# Altium schematic sheet FC_Sheet1.SchDoc
size 431 x 279 mm; SheetNumber: 1; SheetTotal: 1
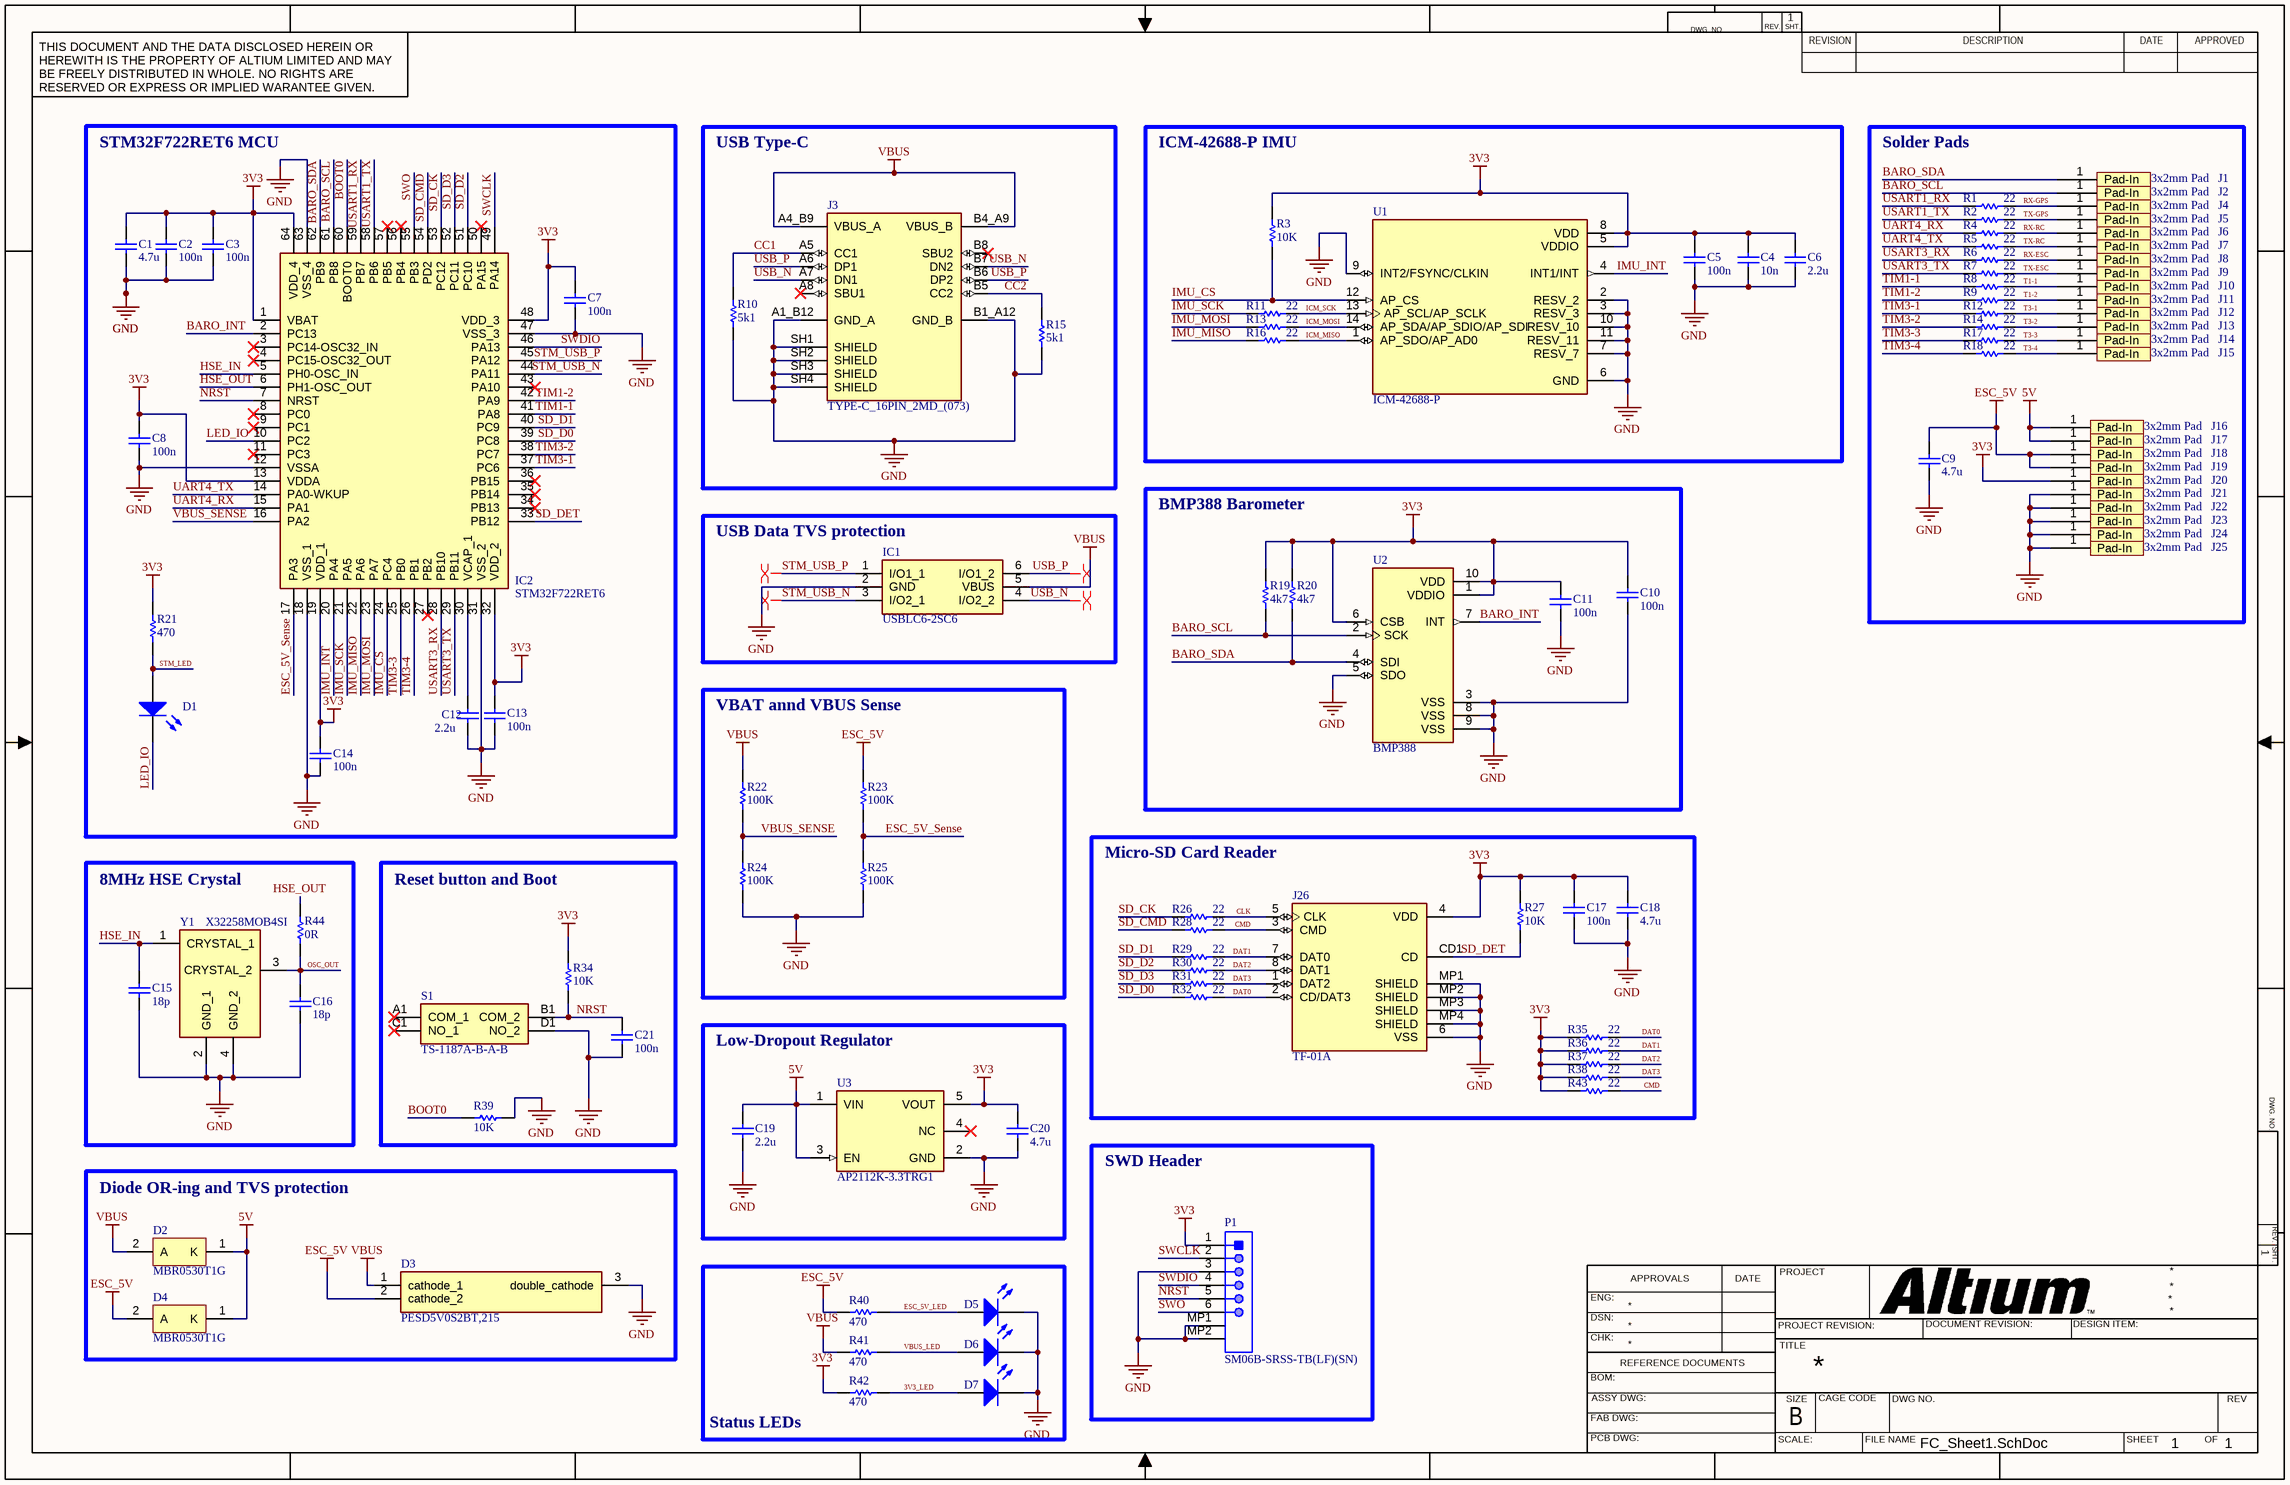
[diagram p0: FC_Sheet1.SchDoc]

## Parts
C1  value 4.7u  [CAPC1608X90X40NL10T20]  (hidden comment: 4.7uF 0603 Capacitor)
C2  value 100n  [CAPC0402(1005)60_L]  (hidden comment: 100nF 0402 Capacitor)
C3  value 100n  [CAPC0402(1005)60_L]  (hidden comment: 100nF 0402 Capacitor)
C4  value 10n  [CAPC0402(1005)60_L]  (hidden comment: 10nF 0402 Capacitor)
C5  value 100n  [CAPC0402(1005)60_L]  (hidden comment: 100nF 0402 Capacitor)
C6  value 2.2u  [CAPC1608X90X40NL10T20]  (hidden comment: 2.2uF 0603 Capacitor)
C7  value 100n  [CAPC0402(1005)60_L]  (hidden comment: 100nF 0402 Capacitor)
C8  value 100n  [CAPC0402(1005)60_L]  (hidden comment: 100nF 0402 Capacitor)
C9  value 4.7u  [CAPC1608X90X40NL10T20]  (hidden comment: 4.7uF 0603 Capacitor)
C10  value 100n  [CAPC0402(1005)60_L]  (hidden comment: 100nF 0402 Capacitor)
C11  value 100n  [CAPC0402(1005)60_L]  (hidden comment: 100nF 0402 Capacitor)
C12  value 2.2u  [CAPC1608X90X40NL10T20]  (hidden comment: 2.2uF 0603 Capacitor)
C13  value 100n  [CAPC0402(1005)60_L]  (hidden comment: 100nF 0402 Capacitor)
C14  value 100n  [CAPC0402(1005)60_L]  (hidden comment: 100nF 0402 Capacitor)
C15  value 18p  [CAPC0402(1005)60_L]  (hidden comment: 18pF 0402 Capacitor)
C16  value 18p  [CAPC0402(1005)60_L]  (hidden comment: 18pF 0402 Capacitor)
C17  value 100n  [CAPC0402(1005)60_L]  (hidden comment: 100nF 0402 Capacitor)
C18  value 4.7u  [CAPC1608X90X40NL10T20]  (hidden comment: 4.7uF 0603 Capacitor)
C19  value 2.2u  [CAPC1608X90X40NL10T20]  (hidden comment: 2.2uF 0603 Capacitor)
C20  value 4.7u  [CAPC1608X90X40NL10T20]  (hidden comment: 4.7uF 0603 Capacitor)
C21  value 100n  [CAPC0402(1005)60_L]  (hidden comment: 100nF 0402 Capacitor)
D1  Red 0603 Light-Emitting Diode  [LTST-C191KRKT_V]  (value not drawn)
D2  MBR0530T1G  [ONSC-SOD-123-2-425-04_V]
D3  PESD5V0S2BT,215  [SOT95P230X110-3N]
D4  MBR0530T1G  [ONSC-SOD-123-2-425-04_V]
D5  Red 0603 Light-Emitting Diode  [LTST-C191KRKT_V]  (value not drawn)
D6  Red 0603 Light-Emitting Diode  [LTST-C191KRKT_V]  (value not drawn)
D7  Red 0603 Light-Emitting Diode  [LTST-C191KRKT_V]  (value not drawn)
IC1  USBLC6-2SC6  [SOT95P280X145-6N]
IC2  STM32F722RET6  [QFP50P1200X1200X160-64N]
J1  3x2mm Pad  [3x2mm Pad-Footprint-1]  (no BOM)
J2  3x2mm Pad  [3x2mm Pad-Footprint-1]  (no BOM)
J3  TYPE-C_16PIN_2MD_(073)  [SHOUHAN_TYPE-C_16PIN_2MD_(073)]
J4  3x2mm Pad  [3x2mm Pad-Footprint-1]  (no BOM)
J5  3x2mm Pad  [3x2mm Pad-Footprint-1]  (no BOM)
J6  3x2mm Pad  [3x2mm Pad-Footprint-1]  (no BOM)
J7  3x2mm Pad  [3x2mm Pad-Footprint-1]  (no BOM)
J8  3x2mm Pad  [3x2mm Pad-Footprint-1]  (no BOM)
J9  3x2mm Pad  [3x2mm Pad-Footprint-1]  (no BOM)
J10  3x2mm Pad  [3x2mm Pad-Footprint-1]  (no BOM)
J11  3x2mm Pad  [3x2mm Pad-Footprint-1]  (no BOM)
J12  3x2mm Pad  [3x2mm Pad-Footprint-1]  (no BOM)
J13  3x2mm Pad  [3x2mm Pad-Footprint-1]  (no BOM)
J14  3x2mm Pad  [3x2mm Pad-Footprint-1]  (no BOM)
J15  3x2mm Pad  [3x2mm Pad-Footprint-1]  (no BOM)
J16  3x2mm Pad  [3x2mm Pad-Footprint-1]  (no BOM)
J17  3x2mm Pad  [3x2mm Pad-Footprint-1]  (no BOM)
J18  3x2mm Pad  [3x2mm Pad-Footprint-1]  (no BOM)
J19  3x2mm Pad  [3x2mm Pad-Footprint-1]  (no BOM)
J20  3x2mm Pad  [3x2mm Pad-Footprint-1]  (no BOM)
J21  3x2mm Pad  [3x2mm Pad-Footprint-1]  (no BOM)
J22  3x2mm Pad  [3x2mm Pad-Footprint-1]  (no BOM)
J23  3x2mm Pad  [3x2mm Pad-Footprint-1]  (no BOM)
J24  3x2mm Pad  [3x2mm Pad-Footprint-1]  (no BOM)
J25  3x2mm Pad  [3x2mm Pad-Footprint-1]  (no BOM)
J26  TF-01A  [TF-01A]
P1  SM06B-SRSS-TB(LF)(SN)  [JST-SM06B-SRSS-TB_V]
R1  value 22  [RESC0402(1005)_L]  (hidden comment: 22R 0402 Resistor)
R2  value 22  [RESC0402(1005)_L]  (hidden comment: 22R 0402 Resistor)
R3  value 10K  [RESC0402(1005)_L]  (hidden comment: 10k 0402 Resistor)
R4  value 22  [RESC0402(1005)_L]  (hidden comment: 22R 0402 Resistor)
R5  value 22  [RESC0402(1005)_L]  (hidden comment: 22R 0402 Resistor)
R6  value 22  [RESC0402(1005)_L]  (hidden comment: 22R 0402 Resistor)
R7  value 22  [RESC0402(1005)_L]  (hidden comment: 22R 0402 Resistor)
R8  value 22  [RESC0402(1005)_L]  (hidden comment: 22R 0402 Resistor)
R9  value 22  [RESC0402(1005)_L]  (hidden comment: 22R 0402 Resistor)
R10  value 5k1  [RESC0402(1005)_L]  (hidden comment: 5k1 0402 Resistor)
R11  value 22  [RESC0402(1005)_L]  (hidden comment: 22R 0402 Resistor)
R12  value 22  [RESC0402(1005)_L]  (hidden comment: 22R 0402 Resistor)
R13  value 22  [RESC0402(1005)_L]  (hidden comment: 22R 0402 Resistor)
R14  value 22  [RESC0402(1005)_L]  (hidden comment: 22R 0402 Resistor)
R15  value 5k1  [RESC0402(1005)_L]  (hidden comment: 5k1 0402 Resistor)
R16  value 22  [RESC0402(1005)_L]  (hidden comment: 22R 0402 Resistor)
R17  value 22  [RESC0402(1005)_L]  (hidden comment: 22R 0402 Resistor)
R18  value 22  [RESC0402(1005)_L]  (hidden comment: 22R 0402 Resistor)
R19  value 4k7  [RESC0402(1005)_L]  (hidden comment: 4k7 0402 Resistor)
R20  value 4k7  [RESC0402(1005)_L]  (hidden comment: 4k7 0402 Resistor)
R21  value 470  [RESC1608X55X25NL10T15]  (hidden comment: 470R 0603 Resistor)
R22  value 100K  [RESC0402(1005)_L]  (hidden comment: 100k 0402 Resistor)
R23  value 100K  [RESC0402(1005)_L]  (hidden comment: 100k 0402 Resistor)
R24  value 100K  [RESC0402(1005)_L]  (hidden comment: 100k 0402 Resistor)
R25  value 100K  [RESC0402(1005)_L]  (hidden comment: 100k 0402 Resistor)
R26  value 22  [RESC0402(1005)_L]  (hidden comment: 22R 0402 Resistor)
R27  value 10K  [RESC0402(1005)_L]  (hidden comment: 10k 0402 Resistor)
R28  value 22  [RESC0402(1005)_L]  (hidden comment: 22R 0402 Resistor)
R29  value 22  [RESC0402(1005)_L]  (hidden comment: 22R 0402 Resistor)
R30  value 22  [RESC0402(1005)_L]  (hidden comment: 22R 0402 Resistor)
R31  value 22  [RESC0402(1005)_L]  (hidden comment: 22R 0402 Resistor)
R32  value 22  [RESC0402(1005)_L]  (hidden comment: 22R 0402 Resistor)
R34  value 10K  [RESC0402(1005)_L]  (hidden comment: 10k 0402 Resistor)
R35  value 22  [RESC0402(1005)_L]  (hidden comment: 22R 0402 Resistor)
R36  value 22  [RESC0402(1005)_L]  (hidden comment: 22R 0402 Resistor)
R37  value 22  [RESC0402(1005)_L]  (hidden comment: 22R 0402 Resistor)
R38  value 22  [RESC0402(1005)_L]  (hidden comment: 22R 0402 Resistor)
R39  value 10K  [RESC0402(1005)_L]  (hidden comment: 10k 0402 Resistor)
R40  value 470  [RESC1608X55X25NL10T15]  (hidden comment: 470R 0603 Resistor)
R41  value 470  [RESC1608X55X25NL10T15]  (hidden comment: 470R 0603 Resistor)
R42  value 470  [RESC1608X55X25NL10T15]  (hidden comment: 470R 0603 Resistor)
R43  value 22  [RESC0402(1005)_L]  (hidden comment: 22R 0402 Resistor)
R44  value 0R  [RESC0402(1005)_L]  (hidden comment: 0R 0402 Resistor)
S1  TS-1187A-B-A-B  [TS1187ABAB]
U1  ICM-42688-P  [PQFN50P300X250X97-14N]
U2  BMP388  [PQFN50P200X200X80-10N]
U3  AP2112K-3.3TRG1  [FP-SOT25-IPC_A]
Y1  X32258MOB4SI  [X32258MOB4SI]

## Blocks framed on the sheet
STM32F722RET6 MCU: C1-C3 C7 C8 C12-C14 D1 IC2 R21
USB Type-C: J3 R10 R15
ICM-42688-P IMU: C4-C6 R3 R11 R13 R16 U1
Solder Pads: C9 J1 J2 J4-J25 R1 R2 R4-R9 R12 R14 R17 R18
USB Data TVS protection: IC1
BMP388 Barometer: C10 C11 R19 R20 U2
VBAT annd VBUS Sense: R22-R25
8MHz HSE Crystal: C15 C16 R44 Y1
Reset button and Boot: C21 R34 R39 S1
Micro-SD Card Reader: C17 C18 J26 R26-R32 R35-R38 R43
Low-Dropout Regulator: C19 C20 U3
Diode OR-ing and TVS protection: D2-D4
SWD Header: P1
Status LEDs: D5-D7 R40-R42

## Nets
3V3: C1.2 C2.2 C3.2 C4.2 C5.2 C6.2 C7.2 C8.2 C10.2 C11.2 C13.2 C14.2 C17.2 C18.2 C20.2 IC2.1(VBAT) IC2.13(VDDA) IC2.19(VDD_1) IC2.32(VDD_2) IC2.48(VDD_3) IC2.64(VDD_4) J20.1(Pad-In) J26.4(VDD) P1.1 R3.2 R19.2 R20.2 R21.1 R27.2 R34.2 R35.2 R36.2 R37.2 R38.2 R42.1 R43.2 U1.5(VDDIO) U1.8(VDD) U2.1(VDDIO) U2.6(CSB) U2.10(VDD) U3.5(VOUT)
5V: C19.2 D2.1(K) D4.1(K) J16.1(Pad-In) J17.1(Pad-In) U3.1(VIN) U3.3(EN)
ESC_5V: C9.2 D3.2(cathode_2) D4.2(A) J18.1(Pad-In) J19.1(Pad-In) R23.2 R40.1
GND: C1.1 C2.1 C3.1 C4.1 C5.1 C6.1 C7.1 C8.1 C9.1 C10.1 C11.1 C12.1 C13.1 C14.1 C15.1 C16.1 C17.1 C18.1 C19.1 C20.1 C21.1 D3.3(double_cathode) D5.2(K) D6.2(K) D7.2(K) IC1.2(GND) IC2.12(VSSA) IC2.18(VSS_1) IC2.31(VSS_2) IC2.47(VSS_3) IC2.63(VSS_4) J3.A1_B12(GND_A) J3.B1_A12(GND_B) J3.SH1(SHIELD) J3.SH2(SHIELD) J3.SH3(SHIELD) J3.SH4(SHIELD) J21.1(Pad-In) J22.1(Pad-In) J23.1(Pad-In) J24.1(Pad-In) J25.1(Pad-In) J26.6(VSS) J26.MP1(SHIELD) J26.MP2(SHIELD) J26.MP3(SHIELD) J26.MP4(SHIELD) P1.3 P1.MP1 P1.MP2 R10.1 R15.1 R24.1 R25.1 R39.1 S1.D1(NO_2) U1.2(RESV_2) U1.3(RESV_3) U1.6(GND) U1.7(RESV_7) U1.9(INT2/FSYNC/CLKIN) U1.10(RESV_10) U1.11(RESV_11) U2.3(VSS) U2.5(SDO) U2.8(VSS) U2.9(VSS) U3.2(GND) Y1.2(GND_1) Y1.4(GND_2)
VBUS: D2.2(A) D3.1(cathode_1) IC1.5(VBUS) J3.A4_B9(VBUS_A) J3.B4_A9(VBUS_B) R22.2 R41.1
3V3_LED: D7.1(A) R42.2
BARO_INT: IC2.2(PC13) U2.7(INT)
BARO_SCL: IC2.61(PB8) J2.1(Pad-In) R19.1 U2.2(SCK)
BARO_SDA: IC2.62(PB9) J1.1(Pad-In) R20.1 U2.4(SDI)
BOOT0: IC2.60(BOOT0) R39.2
CC1: J3.A5(CC1) R10.2
CC2: J3.B5(CC2) R15.2
CLK: J26.5(CLK) R26.1
CMD: J26.3(CMD) R28.1 R43.1
DAT0: J26.2(CD/DAT3) R32.1 R35.1
DAT1: J26.7(DAT0) R29.1 R36.1
DAT2: J26.8(DAT1) R30.1 R37.1
DAT3: J26.1(DAT2) R31.1 R38.1
ESC_5V_LED: D5.1(A) R40.2
ESC_5V_Sense: IC2.17(PA3) R23.1 R25.2
HSE_IN: C15.2 IC2.5(PH0-OSC_IN) Y1.1(CRYSTAL_1)
HSE_OUT: IC2.6(PH1-OSC_OUT) R44.2
ICM_MISO: R16.1 U1.1(AP_SDO/AP_AD0)
ICM_MOSI: R13.1 U1.14(AP_SDA/AP_SDIO/AP_SDI)
ICM_SCK: R11.1 U1.13(AP_SCL/AP_SCLK)
IMU_CS: IC2.24(PC4) R3.1 U1.12(AP_CS)
IMU_INT: IC2.20(PA4) U1.4(INT1/INT)
IMU_MISO: IC2.22(PA6) R16.2
IMU_MOSI: IC2.23(PA7) R13.2
IMU_SCK: IC2.21(PA5) R11.2
LED_IO: D1.2(K) IC2.10(PC2)
NRST: C21.2 IC2.7(NRST) P1.5 R34.1 S1.B1(COM_2)
OSC_OUT: C16.2 R44.1 Y1.3(CRYSTAL_2)
RX-ESC: J8.1(Pad-In) R6.1
RX-GPS: J4.1(Pad-In) R1.1
RX-RC: J6.1(Pad-In) R4.1
SD_CK: IC2.53(PC12) R26.2
SD_CMD: IC2.54(PD2) R28.2
SD_D0: IC2.39(PC8) R32.2
SD_D1: IC2.40(PC9) R29.2
SD_D2: IC2.51(PC10) R30.2
SD_D3: IC2.52(PC11) R31.2
SD_DET: IC2.33(PB12) J26.CD1(CD) R27.1
STM_LED: D1.1(A) R21.2
STM_USB_N: IC1.3(I/O2_1) IC2.44(PA11)
STM_USB_P: IC1.1(I/O1_1) IC2.45(PA12)
SWCLK: IC2.49(PA14) P1.2
SWDIO: IC2.46(PA13) P1.4
SWO: IC2.55(PB3) P1.6
T1-1: J10.1(Pad-In) R8.1
T1-2: J11.1(Pad-In) R9.1
T3-1: J12.1(Pad-In) R12.1
T3-2: J13.1(Pad-In) R14.1
T3-3: J14.1(Pad-In) R17.1
T3-4: J15.1(Pad-In) R18.1
TIM1-1: IC2.41(PA8) R8.2
TIM1-2: IC2.42(PA9) R9.2
TIM3-1: IC2.37(PC6) R12.2
TIM3-2: IC2.38(PC7) R14.2
TIM3-3: IC2.25(PB0) R17.2
TIM3-4: IC2.26(PB1) R18.2
TX-ESC: J9.1(Pad-In) R7.1
TX-GPS: J5.1(Pad-In) R2.1
TX-RC: J7.1(Pad-In) R5.1
UART4_RX: IC2.15(PA1) R4.2
UART4_TX: IC2.14(PA0-WKUP) R5.2
USART1_RX: IC2.59(PB7) R1.2
USART1_TX: IC2.58(PB6) R2.2
USART3_RX: IC2.28(PB10) R6.2
USART3_TX: IC2.29(PB11) R7.2
USB_N: IC1.4(I/O2_2) J3.A7(DN1) J3.B7(DN2)
USB_P: IC1.6(I/O1_2) J3.A6(DP1) J3.B6(DP2)
VBUS_LED: D6.1(A) R41.2
VBUS_SENSE: IC2.16(PA2) R22.1 R24.2
NetC12_2: C12.2 IC2.30(VCAP_1)

Not connected (* = marked no-connect by the designer): IC2 3(PC14-OSC32_IN)* 4(PC15-OSC32_OUT)* 8(PC0)* 9(PC1)* 11(PC3)* 27(PB2)* 34(PB13)* 35(PB14)* 36(PB15)* 43(PA10)* 50(PA15)* 56(PB4)* 57(PB5)*; J3 A8(SBU1)* B8(SBU2)*; S1 A1(COM_1)* C1(NO_1)*; U3 4(NC)*

## Layout directives
differential pair: STM_USB_N, STM_USB_P, USB_N, USB_P

## Notes on the sheet
- DWG. NO.
- REV.
- SHT.
- THIS DOCUMENT AND THE DATA DISCLOSED HEREIN OR HEREWITH IS THE PROPERTY OF ALTIUM LIMITED AND MAY BE FREELY DISTRIBUTED IN WHOLE. NO RIGHTS ARE RESERVED OR EXPRESS OR IMPLIED WARANTEE GIVEN.
- REVISION
- DESCRIPTION
- DATE
- APPROVED
- ENG:
- APPROVALS
- PROJECT
- DSN:
- CHK:
- REFERENCE DOCUMENTS
- PROJECT REVISION:
- TITLE
- DOCUMENT REVISION:
- DESIGN ITEM:
- BOM:
- FAB DWG:
- PCB DWG:
- ASSY DWG:
- SCALE:
- SIZE
- B
- CAGE CODE
- FILE NAME
- DWG NO.
- SHEET
- OF
- REV

## Library data of the parts
C1-C21 = Capacitor: SimulationGenericComponent: True
D1 D5-D7 = LED: AF: 1; BV: 0; BV_MAX: 1e99; EG: 1.11; FC: 0.5; IBV: 0.001; IS: 1e-14; MJSW: 0.33; NTUN: 30; TNOM: 27; XTI: 3; SimulationGenericComponent: True; CJO: 0; CJP: 0; CTA: 0; CTP: 0; FCS: 0.5; FV_MAX: 1e99; IKF: 0; IKR: 0; ISR: 1e-14; JSW: 0; JTUN: 0; JTUNSW: 0; KEG: 1; KF: 0; LEVEL: 1; N: 1; NBV: 1; NR: 1; NS: 1; PHP: 1; RS: 0; TCV: 0; TLEV: 0; TLEVC: 0; TM1: 0; TM2: 0; TPB: 0; TPHP: 0; TRS: 0; TRS2: 0; TT: 0; TTT1: 0; TTT2: 0; VJ: 1; XTITUN: 3
D2 D4 = CMP-1055-00413-1: Schottky Power Rectifier, 2-Pin SOD-123, Pb-Free, Tape and Reel; Manufacturer: On Semiconductor; IFSM Max (A): 5.5; Configuration: Single; PackageVersion: Rev. G, 10/2009; ComponentLink2URL: http://www.onsemi.cn/pub_link/Collateral/MBR0530T1-D.PDF; Packing: Tape and Reel; RoHS: TRUE; ComponentLink1URL: http://www.onsemi.com/; Mounting Technology: Surface Mount; ComponentLink3URL: http://www.onsemi.com/pub_link/Collateral/425-04.PDF; ComponentLink3Description: Package Specification; PartNumber: MBR0530T1G; PackageDescription: 2-Pin SOD, Body 1.6 x 2.69 mm; DatasheetVersion: Rev. 7; PackageReference: SOD-123-2-425-04; ComponentLink1Description: Manufacturer URL; ComponentLink2Description: Datasheet
D3 = PESD5V0S2BT,215: Diode; Manufacturer_Name: Nexperia; Datasheet Link: https://assets.nexperia.com/documents/data-sheet/PESD5V0S2BT.pdf; Height: 1.1mm; Manufacturer_Part_Number: PESD5V0S2BT,215; Mouser Part Number: 771-PESD5V0S2BT-T/R; Mouser Price/Stock: https://www.mouser.co.uk/ProductDetail/Nexperia/PESD5V0S2BT215?qs=LOCUfHb8d9vg1bGYYJyeQQ%3D%3D; Arrow Part Number: PESD5V0S2BT,215; Arrow Price/Stock: https://www.arrow.com/en/products/pesd5v0s2bt215/nexperia?region=nac
IC1 = USBLC6-2SC6: Integrated Circuit; Manufacturer_Name: STMicroelectronics; Datasheet Link: https://www.st.com/resource/en/datasheet/usblc6-2.pdf; Height: 1.45mm; Manufacturer_Part_Number: USBLC6-2SC6; Mouser Part Number: 511-USBLC6-2SC6; Mouser Price/Stock: https://www.mouser.co.uk/ProductDetail/STMicroelectronics/USBLC6-2SC6?qs=po45yt2pPpu%2FhNIlwQdTlg%3D%3D; Arrow Part Number: USBLC6-2SC6; Arrow Price/Stock: https://www.arrow.com/en/products/usblc6-2sc6/stmicroelectronics?utm_currency=USD&region=europe
IC2 = STM32F722RET6: Integrated Circuit; Manufacturer_Name: STMicroelectronics; Datasheet Link: https://www.st.com/resource/en/datasheet/stm32f722ic.pdf; Height: 1.6mm; Manufacturer_Part_Number: STM32F722RET6; Mouser Part Number: 511-STM32F722RET6; Mouser Price/Stock: https://www.mouser.co.uk/ProductDetail/STMicroelectronics/STM32F722RET6?qs=NoqMqJKvPFLRYC3WLxVXLQ%3D%3D; Arrow Part Number: STM32F722RET6; Arrow Price/Stock: https://www.arrow.com/en/products/stm32f722ret6/stmicroelectronics?utm_currency=USD&region=nac
J1 J2 J4-J25 = CMP-002-00076-4: 3mm x 2mm Pad to solder
J3 = CMP-025-000000-1: DC-5V 5A Type C USB; MP: TYPE-C 16PIN 2MD (073); MF: Shouhan; Source: TYPE-C_16PIN_2MD_(073).SchLib; Component Type: Standard; Check_prices: https://www.snapeda.com/parts/TYPE-C%2016PIN%202MD%20(073)/Shouhan/view-part/?ref=eda; Design Item ID: TYPE-C_16PIN_2MD_(073); Value: *; SnapEDA_Link: https://www.snapeda.com/parts/TYPE-C%2016PIN%202MD%20(073)/Shouhan/view-part/?ref=snap; Pin Count: 16; Package: Package
J26 = CMP-029-000000-5: Standard Card Edge Connectors; MF: HRO Electronics Co., Ltd.; Pin Count: 13; Price: None; Check_prices: https://www.snapeda.com/parts/TF-01A/HRO+Electronics+Co.%252C+Ltd./view-part/?ref=eda; Component Type: Standard; MP: TF-01A; Value: *; Design Item ID: TF-01A; Availability: Not in stock; Source: TF-01A.SchLib; Package: Package; SnapEDA_Link: https://www.snapeda.com/parts/TF-01A/HRO+Electronics+Co.%252C+Ltd./view-part/?ref=snap
P1 = CMP-2000-07080-1: Male Header, Pitch 1 mm, 1 x 6 Position, Height 2.95 mm, -25 to 85 degC, RoHS, Tape and Reel; Manufacturer: JST; No of Positions: 6; Pitch: 1mm; Style/Orientation: RightAngleHeader/Plug; Datasheet URL: https://datasheet.ciiva.com/26894/getdatasheetpartid-708885-26894671.pdf; Package Description: Male Header, Pitch 1 mm, 1 X 6 Position, Height 2.9 mm; Termination: Solder; Manufacturer URL: http://www.jst.com/home2.html; Type: ShroudedHeader; Package Reference: SM06B-SRSS-TB; Datasheet Version: 11/2010; Mounting Technology: SurfaceMount
R1-R32 R34-R44 = Resistor: TC1: 0; SimulationGenericComponent: True; TC2: 0
S1 = TS-1187A-B-A-B: Switch; Manufacturer_Name: XKB Connectivity; Datasheet Link: http://www.helloxkb.com/public/images/pdf/TS-1187A-X-X-X.pdf; Height: 4.05mm; Manufacturer_Part_Number: TS-1187A-B-A-B
U1 = CMP-021-000000-2: Accelerometer, Gyroscope, 6 Axis Sensor Output; Availability: Unavailable; Source: ICM-42688-P.SchLib; Pin Count: 14; Value: *; Package: None; MP: ICM-42688-P; Design Item ID: ICM-42688-P; Price: None; Component Type: Standard
U2 = CMP-031-00007-2: P-Sensor SPI I2C 1, 25 Bar SMD; Design Item ID: BMP388; MP: BMP388; Pins: 10; Availability: Unavailable; Value: *; Source: BMP388.SchLib; Price: None; Component Type: Standard; Case/Package: None
U3 = CMP-12756-000035-1: IC REG LINEAR 3.3V 600MA SOT25; Number of Regulators: 1; Output Type: Fixed; Polarity: Positive; Min Input Voltage: 2.5V; Max Input Voltage: 6V; Accuracy: 1.5%; Quiescent Current: 55uA; Dropout Voltage: 250mV; Min Operating Temperature: -40°C; Length: 3.1mm; Output Current: 600mA; Max Operating Temperature: 85°C; Package Quantity: 1; Output Voltage: 3.3V; Width: 1.7mm; Number of Outputs: 1; Packaging: Tape and Reel; Height: 1.3mm; Lead Free: Lead Free; Max Output Current: 600mA; Case/Package: SOT-23-5; Mount: Surface Mount; Number of Pins: 5
Y1 = X32258MOB4SI: Crystal or Oscillator; Manufacturer_Name: YXC; Datasheet Link: https://item.szlcsc.com/datasheet/X32258MOB4SI/2777872.html; Height: 0.8mm; Manufacturer_Part_Number: X32258MOB4SI